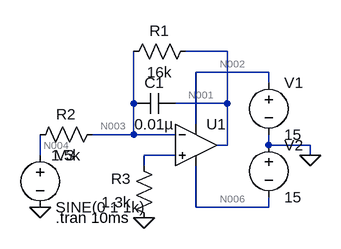
[diagram p0: schematic Draft1.asc]
Draft1.asc, the LTspice schematic file:
Version 4
SHEET 1 880 680
WIRE 320 -64 256 -64
WIRE 384 -32 272 -32
WIRE 384 -16 384 -32
WIRE 176 16 176 -64
WIRE 320 16 320 -64
WIRE 320 16 240 16
WIRE 272 48 272 -32
WIRE 176 64 176 16
WIRE 176 64 112 64
WIRE 240 64 176 64
WIRE 320 80 320 16
WIRE 320 80 304 80
WIRE 384 80 384 64
WIRE 448 80 384 80
WIRE 32 96 32 64
WIRE 240 96 192 96
WIRE 448 96 448 80
WIRE 192 112 192 96
WIRE 272 176 272 112
WIRE 384 176 384 160
WIRE 384 176 272 176
FLAG 32 176 0
FLAG 192 192 0
FLAG 448 96 0
SYMBOL voltage 384 -32 R0
SYMATTR InstName V1
SYMATTR Value 15
SYMBOL res 272 -80 R90
WINDOW 0 0 56 VBottom 2
WINDOW 3 32 56 VTop 2
SYMATTR InstName R1
SYMATTR Value 16k
SYMBOL OpAmps\\UniversalOpAmp 272 80 R0
SYMATTR InstName U1
SYMBOL voltage 384 64 R0
SYMATTR InstName V2
SYMATTR Value 15
SYMBOL cap 240 0 R90
WINDOW 0 0 32 VBottom 2
WINDOW 3 32 32 VTop 2
SYMATTR InstName C1
SYMATTR Value 0.01µ
SYMBOL res 128 48 R90
WINDOW 0 0 56 VBottom 2
WINDOW 3 32 56 VTop 2
SYMATTR InstName R2
SYMATTR Value 1.5k
SYMBOL res 208 208 R180
WINDOW 0 36 76 Left 2
WINDOW 3 36 40 Left 2
SYMATTR InstName R3
SYMATTR Value 1.3k
SYMBOL voltage 32 80 R0
WINDOW 123 0 0 Left 0
WINDOW 39 0 0 Left 0
SYMATTR InstName V3
SYMATTR Value SINE(0 1 1k)
TEXT 56 192 Left 2 !.tran 10ms

The netlist it stands for:
* Draft1.asc
V1 N002 0 15
R1 N001 N003 16k
XU1 N005 N003 N002 N006 N001 level1 Avol=1Meg GBW=10Meg Vos=0 En=0 Enk=0 In=0 Ink=0 Rin=500Meg  ; pins In+ In- V+ V- OUT
V2 0 N006 15
C1 N001 N003 0.01µ
R2 N003 N004 1.5k
R3 0 N005 1.3k
V3 N004 0 SINE(0 1 1k)
.tran 10ms
.lib UniversalOpAmp1.lib
.backanno
.end

* Results of the author's LTspice run, read from the files saved beside the schematic
* Operating Point, zero values left out:
*   V(n002) = 15 V
*   V(n006) = -15 V
*   I(V1) = -30 nA
*   I(V2) = -30 nA
*   Ix(u1:3) = 30 nA
*   Ix(u1:4) = -30 nA
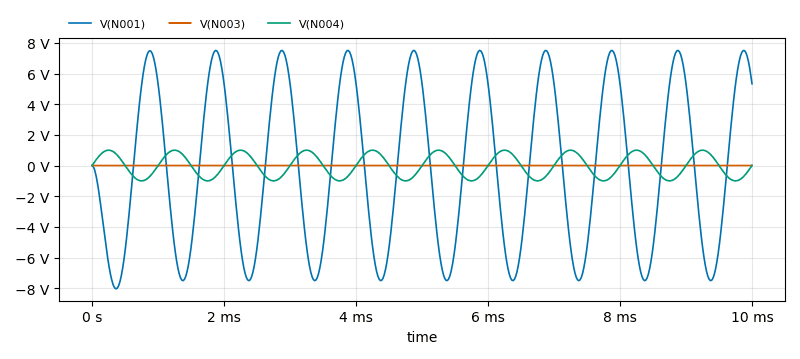
[diagram p1: Transient Analysis of Draft1.asc, plotted from the saved traces]
* Transient Analysis, 1 run:
*   V(N001): min -8.04 V, max 7.51 V, average -85.56 mV, rms 5.332 V, last 5.334 V
*   V(N003): min -761.7 µV, max 751.3 µV, average -8.392 µV, rms 524.9 µV, last 524.6 µV
*   V(N004): min -1 V, max 1 V, average 22.63 µV, rms 707.1 mV, last 0 V